# EAGLE design Reference_Design (EAGLE 9.5.1)
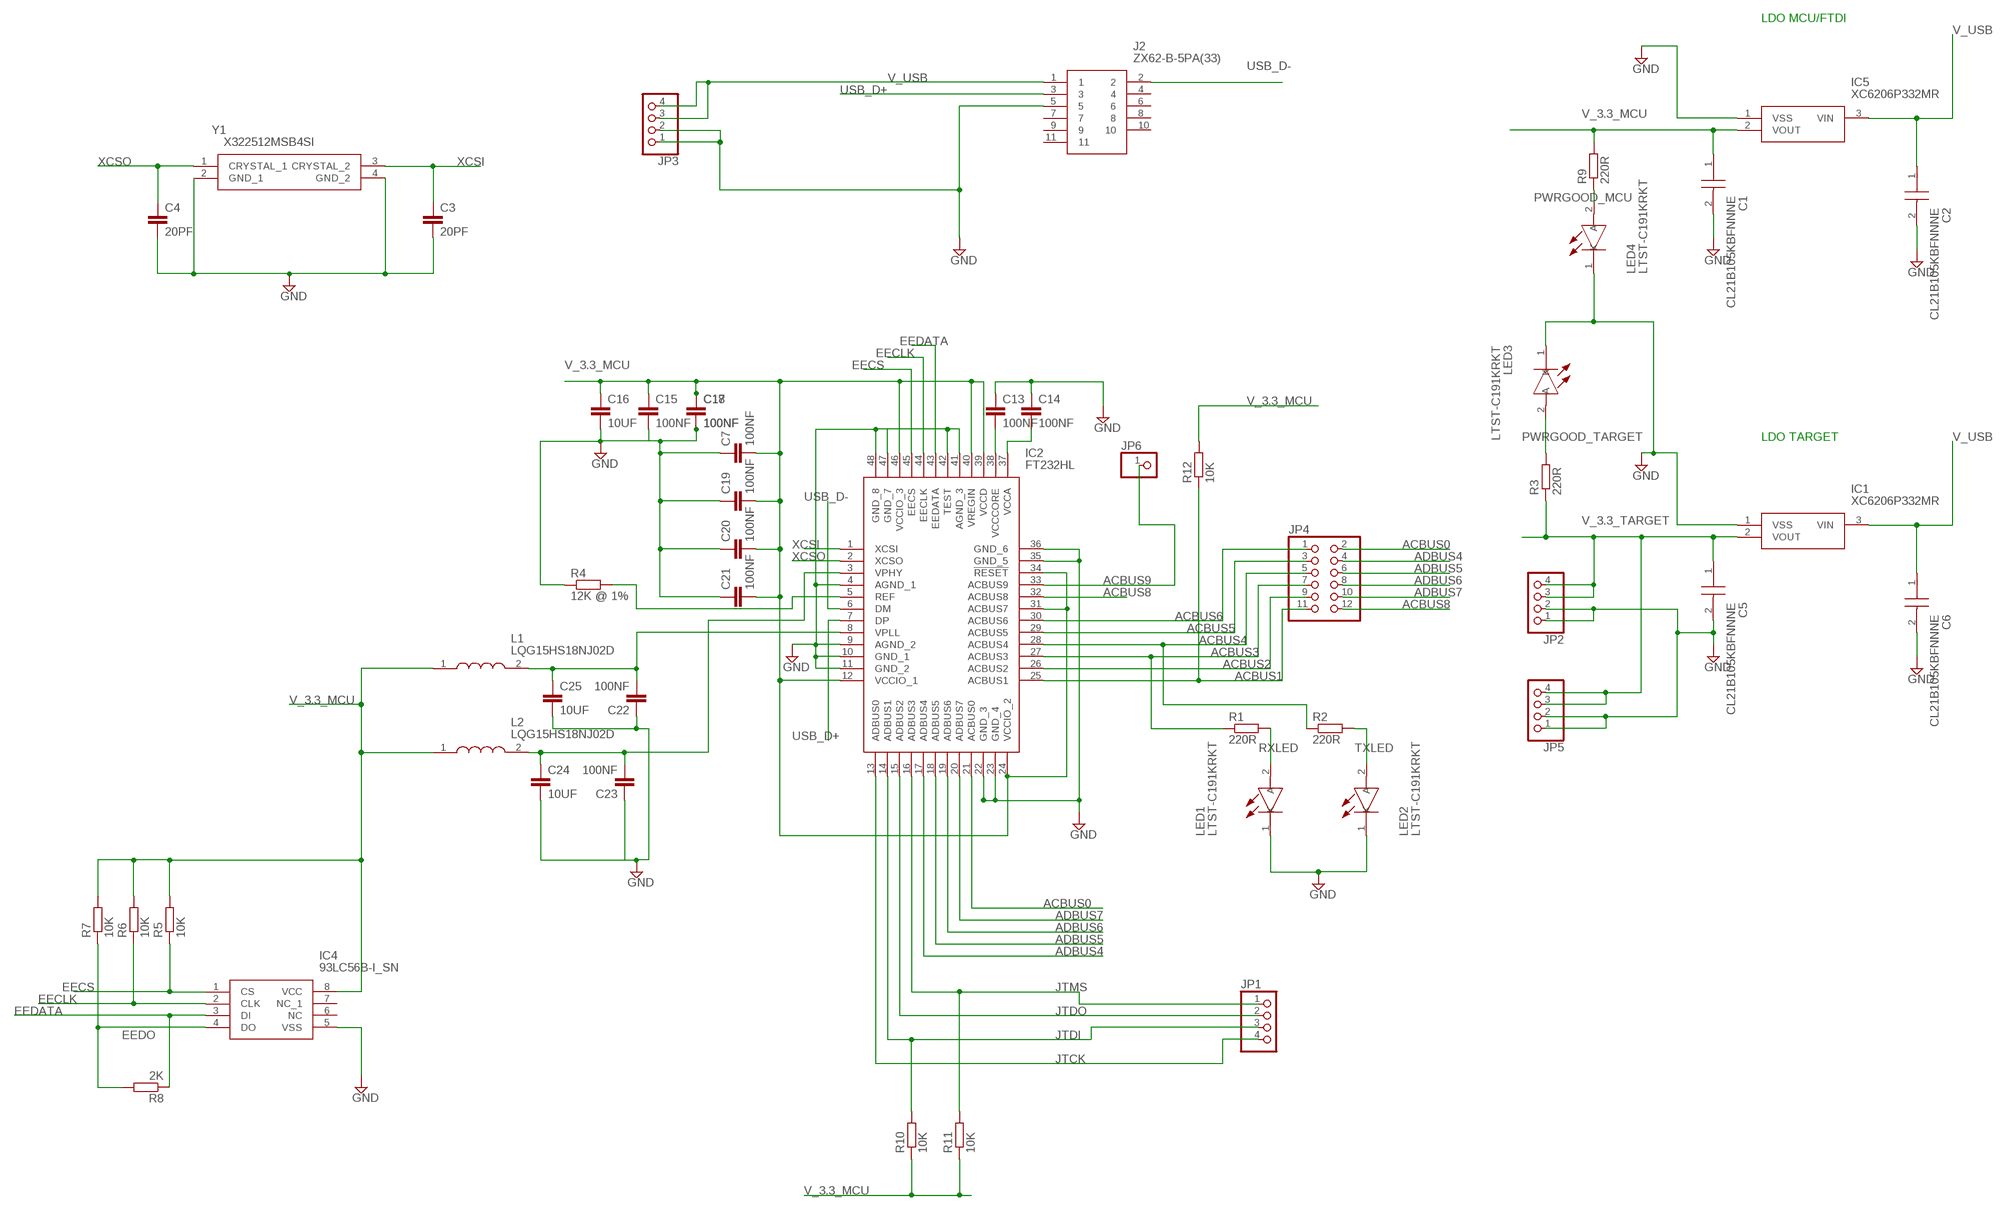
[diagram p0: schematic, sheet 1]

## Parts
C1  CL21B105KBFNNNE  [CAPC2012X135N]
C2  CL21B105KBFNNNE  [CAPC2012X135N]
C3  20PF  C-EUC0603  [C0603]
C4  20PF  C-EUC0603  [C0603]
C5  CL21B105KBFNNNE  [CAPC2012X135N]
C6  CL21B105KBFNNNE  [CAPC2012X135N]
C7  100NF  C-EUC0603  [C0603]
C13  100NF  C-EUC0603  [C0603]
C14  100NF  C-EUC0603  [C0603]
C15  100NF  C-EUC0603  [C0603]
C16  10UF  C-EUC1206  [C1206]
C17  100NF  C-EUC0603  [C0603]
C18  100NF  C-EUC0603  [C0603]
C19  100NF  C-EUC0603  [C0603]
C20  100NF  C-EUC0603  [C0603]
C21  100NF  C-EUC0603  [C0603]
C22  100NF  C-EUC0603  [C0603]
C23  100NF  C-EUC0603  [C0603]
C24  10UF  C-EUC1206  [C1206]
C25  10UF  C-EUC1206  [C1206]
IC1  XC6206P332MR  [SOT95P280X130-3N]
IC2  FT232HL  FT232HL-REEL  [QFP50P900X900X160-48N]
IC4  93LC56B-I_SN  [SOIC127P600X175-8N]
IC5  XC6206P332MR  [SOT95P280X130-3N]
J2  ZX62-B-5PA(33)  [ZX62B5PA33]
JP1  PINHD-1X4  [1X04]
JP2  PINHD-1X4  [1X04]
JP3  PINHD-1X4  [1X04]
JP4  PINHD-2X6  [2X06]
JP5  PINHD-1X4  [1X04]
JP6  PINHD-1X1  [1X01]
L1  LQG15HS18NJ02D  [INDC1005X55N]
L2  LQG15HS18NJ02D  [INDC1005X55N]
LED1  LTST-C191KRKT  [LEDC1608X55N]
LED2  LTST-C191KRKT  [LEDC1608X55N]
LED3  LTST-C191KRKT  [LEDC1608X55N]
LED4  LTST-C191KRKT  [LEDC1608X55N]
R1  220R  R-EU_R0603  [R0603]
R2  220R  R-EU_R0603  [R0603]
R3  220R  R-EU_R0603  [R0603]
R4  12K @ 1%  R-EU_R0603  [R0603]
R5  10K  R-EU_R1206  [R1206]
R6  10K  R-EU_R1206  [R1206]
R7  10K  R-EU_R1206  [R1206]
R8  2K  R-EU_R1206  [R1206]
R9  220R  R-EU_R0603  [R0603]
R10  10K  R-EU_R1206  [R1206]
R11  10K  R-EU_R1206  [R1206]
R12  10K  R-EU_R1206  [R1206]
Y1  X322512MSB4SI  [X322512MSB4SI]

## Nets
ACBUS0: IC2.21(ACBUS0) JP4.2
ACBUS1: IC2.25(ACBUS1) JP4.11 R12.1
ACBUS2: IC2.26(ACBUS2) JP4.9
ACBUS3: IC2.27(ACBUS3) JP4.7 R1.1
ACBUS4: IC2.28(ACBUS4) JP4.5 R2.1
ACBUS5: IC2.29(ACBUS5) JP4.3
ACBUS6: IC2.30(ACBUS6) JP4.1
ACBUS8: IC2.32(ACBUS8) JP4.12
ACBUS9: IC2.33(ACBUS9) JP6.1
ADBUS4: IC2.17(ADBUS4) JP4.4
ADBUS5: IC2.18(ADBUS5) JP4.6
ADBUS6: IC2.19(ADBUS6) JP4.8
ADBUS7: IC2.20(ADBUS7) JP4.10
EECLK: IC2.44(EECLK) IC4.2(CLK) R6.1
EECS: IC2.45(EECS) IC4.1(CS) R5.1
EEDATA: IC2.43(EEDATA) IC4.3(DI) R8.1
EEDO: IC4.4(DO) R7.1 R8.2
GND: C1.2 C2.2 C3.2 C4.2 C5.2 C6.2 C7.1 C13.1 C14.1 C15.2 C16.2 C17.2 C18.2 C19.1 C20.1 C21.1 C22.1 C23.1 C24.2 C25.2 IC1.1(VSS) IC2.4(AGND_1) IC2.9(AGND_2) IC2.10(GND_1) IC2.11(GND_2) IC2.22(GND_3) IC2.23(GND_4) IC2.35(GND_5) IC2.36(GND_6) IC2.41(AGND_3) IC2.42(TEST) IC2.47(GND_7) IC2.48(GND_8) IC4.5(VSS) IC5.1(VSS) J2.5 JP2.1 JP2.2 JP3.1 JP3.2 JP5.1 JP5.2 LED1.1(K) LED2.1(K) LED3.1(K) LED4.1(K) R4.1 Y1.2(GND_1) Y1.4(GND_2)
JTCK: IC2.13(ADBUS0) JP1.4
JTDI: IC2.14(ADBUS1) JP1.3 R10.2
JTDO: IC2.15(ADBUS2) JP1.2
JTMS: IC2.16(ADBUS3) JP1.1 R11.2
PWRGOOD_MCU: LED4.2(A) R9.1
PWRGOOD_TARGET: LED3.2(A) R3.2
REF: IC2.5(REF) R4.2
RXLED: LED1.2(A) R1.2
TXLED: LED2.2(A) R2.2
USB_D+: IC2.7(DP) J2.3
USB_D-: IC2.6(DM) J2.2
V_3.3_MCU: C1.1 C7.2 C15.1 C16.1 C17.1 C18.1 C19.2 C20.2 C21.2 IC2.12(VCCIO_1) IC2.24(VCCIO_2) IC2.31(ACBUS7) IC2.34(!RESET) IC2.39(VCCD) IC2.40(VREGIN) IC2.46(VCCIO_3) IC4.8(VCC) IC5.2(VOUT) L1.1 L2.1 R5.2 R6.2 R7.2 R9.2 R10.1 R11.1 R12.2
V_3.3_TARGET: C5.1 IC1.2(VOUT) JP2.3 JP2.4 JP5.3 JP5.4 R3.1
V_USB: C2.1 C6.1 IC1.3(VIN) IC5.3(VIN) J2.1 JP3.3 JP3.4
VCCA: C14.2 IC2.37(VCCA)
VCCCORE: C13.2 IC2.38(VCCCORE)
VPHY: C23.2 C24.1 IC2.3(VPHY) L2.2
VPLL: C22.2 C25.1 IC2.8(VPLL) L1.2
XCSI: C3.1 IC2.1(XCSI) Y1.3(CRYSTAL_2)
XCSO: C4.1 IC2.2(XCSO) Y1.1(CRYSTAL_1)
Unconnected: IC4.6(NC) IC4.7(NC_1) J2.4 J2.6 J2.7 J2.8 J2.9 J2.10 J2.11

## Notes on the sheet
- LDO MCU/FTDI
- LDO TARGET

## Library data of the parts
C1 C2 C5 C6 = SamacSys:CL21B105KBFNNNE: SAMSUNG ELECTRO-MECHANICS - CL21B105KBFNNNE - CERAMIC MULTILAYER MLCC CAPACITORS- SMD Source: Datasheet <https://componentsearchengine.com/Datasheets/2/CL21B105KBFNNNE.pdf>; DESCRIPTION: SAMSUNG ELECTRO-MECHANICS - CL21B105KBFNNNE - CERAMIC MULTILAYER MLCC CAPACITORS- SMD; HEIGHT: 1.35mm; MANUFACTURER_NAME: Samsung Electro-Mechanics; MANUFACTURER_PART_NUMBER: CL21B105KBFNNNE; MOUSER_PART_NUMBER: N/A; MOUSER_PRICE-STOCK: https://www.mouser.com/Search/Refine.aspx?Keyword=N%2FA
C3 C4 C7 C13-C25 = rcl:C-EU: CAPACITOR, European symbol; SPICEPREFIX: C
IC1 IC5 = SamacSys:XC6206P332MR: Low ESR Cap.Compatible Postive Voltage Regulators Source: Datasheet <http://www.torexsemi.com/products/voltage_regulators/data/XC6206.pdf>; DESCRIPTION: Low ESR Cap.Compatible Postive Voltage Regulators; HEIGHT: 1.3mm; MANUFACTURER_NAME: Torex; MANUFACTURER_PART_NUMBER: XC6206P332MR
IC2 = SamacSys:FT232HL-REEL: USB 2.0 to UART/FIFO Interface, LQFP48 FTDI Chip FT232HL-REEL Universal Asynchronous Receiver & Transmitter RS232, RS422, RS485 UART 12Mbit/s, 1.8 V, 3.3 V Source: Datasheet <http://www.ftdichip.com/Support/Documents/DataSheets/ICs/DS_FT232H.pdf>; ALLIED_NUMBER: 70069390; ALLIED_PRICE-STOCK: http://www.alliedelec.com/ftdi-ft232hl-reel/70069390/; DESCRIPTION: USB 2.0 to UART/FIFO Interface, LQFP48 FTDI Chip FT232HL-REEL Universal Asynchronous Receiver & Transmitter RS232, RS422, RS485 UART 12Mbit/s, 1.8 V, 3.3 V; HEIGHT: 1.6mm; MANUFACTURER_NAME: FTDI Chip; MANUFACTURER_PART_NUMBER: FT232HL-REEL; MOUSER_PART_NUMBER: 895-FT232HL-REEL; MOUSER_PRICE-STOCK: https://www.mouser.com/Search/Refine.aspx?Keyword=895-FT232HL-REEL; RS_PART_NUMBER: 7377843P; RS_PRICE-STOCK: http://uk.rs-online.com/web/p/products/7377843P
IC4 = SamacSys:93LC56B-I_SN: 2K,128 X 16,Serial EE,SOIC-8 Source: Datasheet <http://ww1.microchip.com/downloads/en/DeviceDoc/21794G.pdf>; ALLIED_NUMBER: 70045309; ALLIED_PRICE-STOCK: http://www.alliedelec.com/microchip-technology-inc-93lc56b-i-sn/70045309/; DESCRIPTION: 2K,128 X 16,Serial EE,SOIC-8; HEIGHT: 1.75mm; MANUFACTURER_NAME: Microchip; MANUFACTURER_PART_NUMBER: 93LC56B-I/SN; MOUSER_PART_NUMBER: 579-93LC56BISN; MOUSER_PRICE-STOCK: https://www.mouser.com/Search/Refine.aspx?Keyword=579-93LC56BISN; RS_PART_NUMBER: 0454347P; RS_PRICE-STOCK: http://uk.rs-online.com/web/p/products/0454347P
J2 = SamacSys:ZX62-B-5PA(33): USB Connectors MICRO B RECEPT RA SMT BTTM MNT Source: Datasheet <http://www.mouser.com/ds/2/185/ZX_catalog-939768.pdf>; DESCRIPTION: USB Connectors MICRO B RECEPT RA SMT BTTM MNT; HEIGHT: 2.8mm; MANUFACTURER_NAME: Hirose; MANUFACTURER_PART_NUMBER: ZX62-B-5PA(33); MOUSER_PART_NUMBER: 798-ZX62-B-5PA33; MOUSER_PRICE-STOCK: https://www.mouser.com/Search/Refine.aspx?Keyword=798-ZX62-B-5PA33; RS_PART_NUMBER: 1362267; RS_PRICE-STOCK: http://uk.rs-online.com/web/p/products/1362267
JP1-JP3 JP5 = pinhead:PINHD-1X4: PIN HEADER
JP4 = pinhead:PINHD-2X6: PIN HEADER
JP6 = pinhead:PINHD-1X1: PIN HEADER
L1 L2 = SamacSys:LQG15HS18NJ02D: Murata LQQ15HN Series Wire-wound SMD Inductor 0.018 uH +/-5% 300mA Idc Q:8 Source: Datasheet <https://psearch.en.murata.com/inductor/product/LQG15HS18NJ02#.html>; DESCRIPTION: Murata LQQ15HN Series Wire-wound SMD Inductor 0.018 uH +/-5% 300mA Idc Q:8; HEIGHT: 0.55mm; MANUFACTURER_NAME: Murata Electronics; MANUFACTURER_PART_NUMBER: LQG15HS18NJ02D; MOUSER_PART_NUMBER: 81-LQG15HS18NJ02D; MOUSER_PRICE-STOCK: https://www.mouser.com/Search/Refine.aspx?Keyword=81-LQG15HS18NJ02D; RS_PART_NUMBER: 7254910; RS_PRICE-STOCK: https://uk.rs-online.com/web/p/products/7254910
LED1-LED4 = SamacSys:LTST-C191KRKT: Standard LEDs - SMD Red Clear 631nm Source: Datasheet <http://www.mouser.com/ds/2/239/S_110_LTST-C191KRKT-539838.pdf>; DESCRIPTION: Standard LEDs - SMD Red Clear 631nm; HEIGHT: 0.55mm; MANUFACTURER_NAME: Lite-On; MANUFACTURER_PART_NUMBER: LTST-C191KRKT; MOUSER_PART_NUMBER: 859-LTST-C191KRKT; MOUSER_PRICE-STOCK: https://www.mouser.com/Search/Refine.aspx?Keyword=859-LTST-C191KRKT; RS_PART_NUMBER: 1278415P; RS_PRICE-STOCK: http://uk.rs-online.com/web/p/products/1278415P
R1-R12 = rcl:R-EU_: RESISTOR, European symbol; SPICEPREFIX: R
Y1 = SamacSys:X322512MSB4SI: SMD Crystal Resonators 12MHz +/-10ppm SMD-3225_4P RoHS Source: Datasheet <https://datasheet.lcsc.com/szlcsc/Yangxing-Tech-X322512MSB4SI_C9002.pdf>; DESCRIPTION: SMD Crystal Resonators 12MHz +/-10ppm SMD-3225_4P RoHS; HEIGHT: 0.8mm; MANUFACTURER_NAME: Yangxing Tech; MANUFACTURER_PART_NUMBER: X322512MSB4SI

## Board
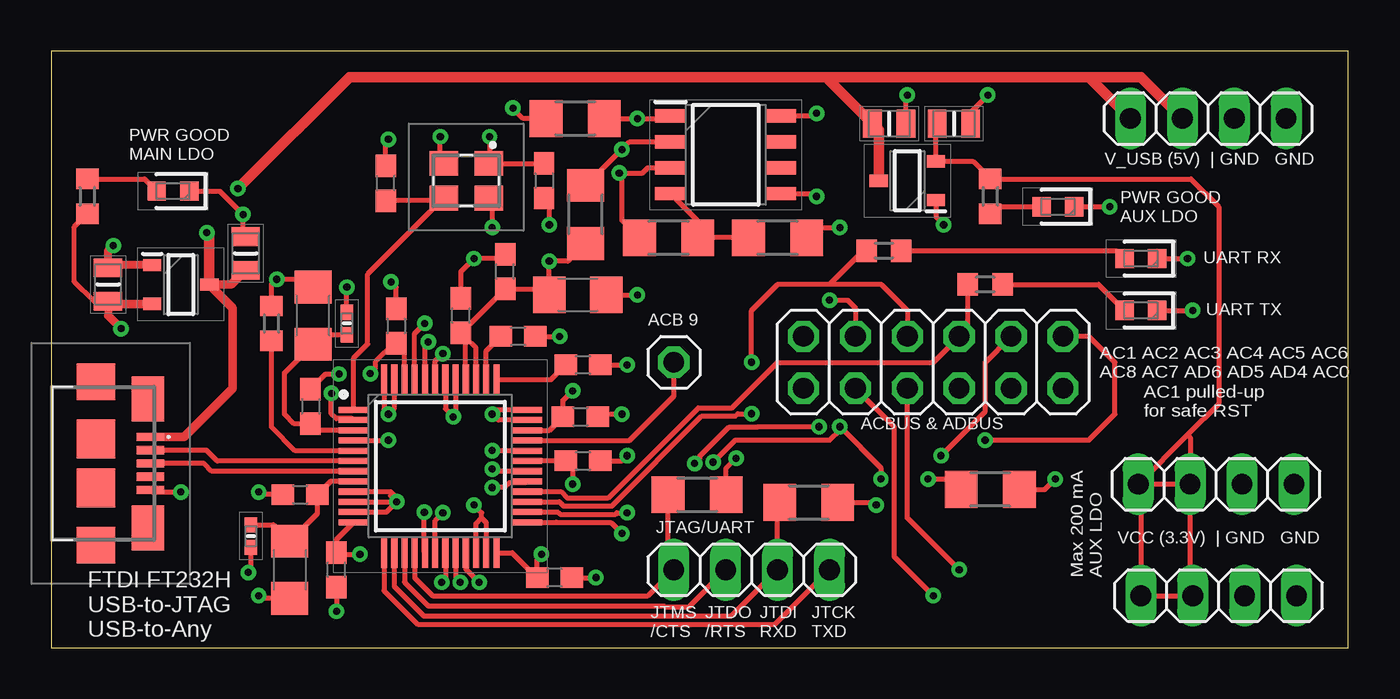
[diagram p1: board, top side]
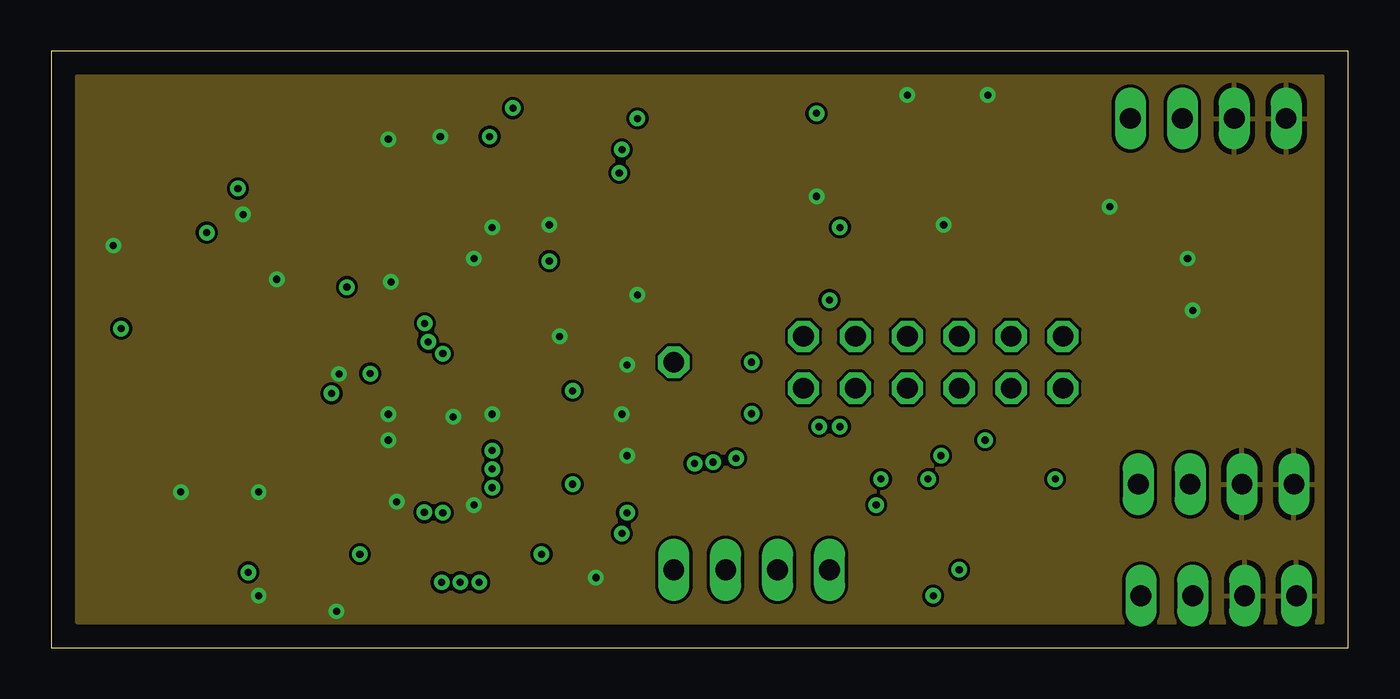
[diagram p2: board, inner layer Route2]
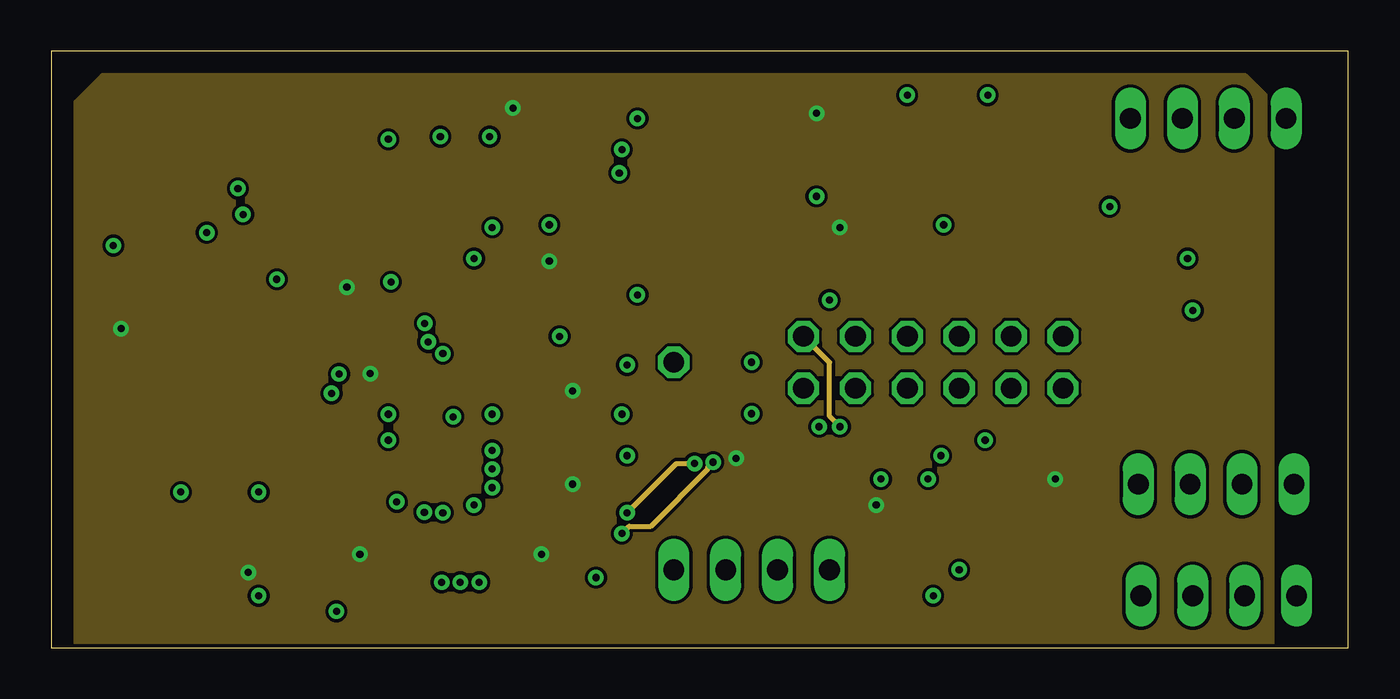
[diagram p3: board, inner layer Route15]
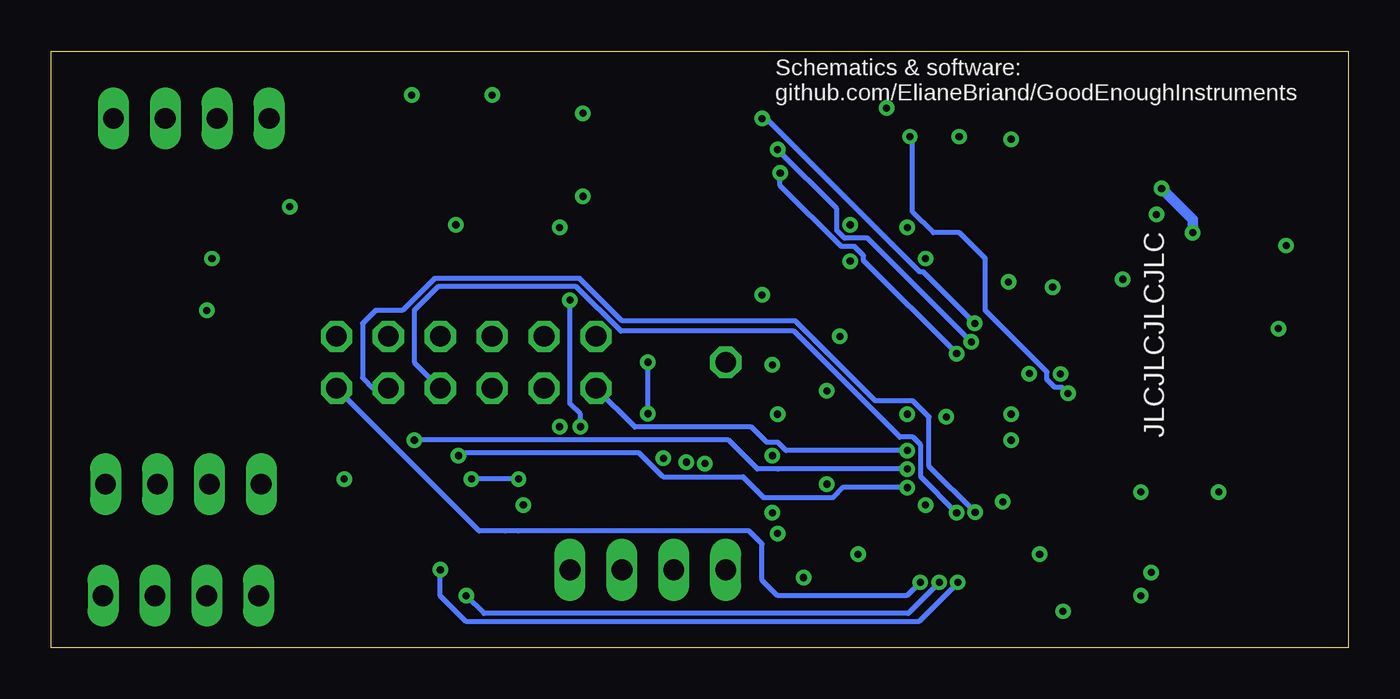
[diagram p4: board, bottom side, seen from below]

Size 63.5 x 29.21 mm. Coordinates in mm from the lower left corner, seen from the top.
Outline: 0,0 63.5,0 63.5,29.21 0,29.21 0,0
Copper layers (1+2*15+16): Top 0.035mm / dielectric 1.5mm / Route2 0.035mm / dielectric 0.15mm / Route15 0.035mm / dielectric 0.2mm / Bottom 0.035mm
Design rules "JLCPCB_MoreThanMinimum": minimum track width 6mil, minimum drill 0.35mm, track to track 6mil, track to pad 6mil, pad to pad 6mil, via to via 6mil, smd to smd 6mil, copper to edge 0.2mm, drill to drill 6mil, minimum pad ring 10mil, minimum via ring 8mil, stop-mask expansion 4mil, vias tented up to drill 0mil, thermal gap 10mil

### Footprints (pad centres in the part's own frame; a part is rotated, then mirrored left to right if it is on the bottom)
CAPC2012X135N = smd 0.91 x 1.39: 1 -0.82,0; 2 0.82,0
C0603 = smd 1.1 x 1: 1 -0.85,0; 2 0.85,0
C1206 = smd 1.6 x 1.8: 1 -1.4,0; 2 1.4,0
SOT95P280X130-3N = smd 0.9 x 0.6: 1 -1.4,0.95; 2 -1.4,-0.95; 3 1.4,0
QFP50P900X900X160-48N = smd 1.475 x 0.3: 1 -4.238,2.75; 2 -4.238,2.25; 3 -4.238,1.75; 4 -4.238,1.25; 5 -4.238,0.75; 6 -4.238,0.25; 7 -4.238,-0.25; 8 -4.238,-0.75; 9 -4.238,-1.25; 10 -4.238,-1.75; 11 -4.238,-2.25; 12 -4.238,-2.75; 25 4.238,-2.75; 26 4.238,-2.25; 27 4.238,-1.75; 28 4.238,-1.25; 29 4.238,-0.75; 30 4.238,-0.25; 31 4.238,0.25; 32 4.238,0.75; 33 4.238,1.25; 34 4.238,1.75; 35 4.238,2.25; 36 4.238,2.75 | smd 0.3 x 1.475: 13 -2.75,-4.238; 14 -2.25,-4.238; 15 -1.75,-4.238; 16 -1.25,-4.238; 17 -0.75,-4.238; 18 -0.25,-4.238; 19 0.25,-4.238; 20 0.75,-4.238; 21 1.25,-4.238; 22 1.75,-4.238; 23 2.25,-4.238; 24 2.75,-4.238; 37 2.75,4.238; 38 2.25,4.238; 39 1.75,4.238; 40 1.25,4.238; 41 0.75,4.238; 42 0.25,4.238; 43 -0.25,4.238; 44 -0.75,4.238; 45 -1.25,4.238; 46 -1.75,4.238; 47 -2.25,4.238; 48 -2.75,4.238
SOIC127P600X175-8N = smd 1.5 x 0.65: 1 -2.7,1.905; 2 -2.7,0.635; 3 -2.7,-0.635; 4 -2.7,-1.905; 5 2.7,-1.905; 6 2.7,-0.635; 7 2.7,0.635; 8 2.7,1.905
ZX62B5PA33 = smd 0.4 x 1.35: 1 -1.3,1.95; 2 -0.65,1.95; 3 0,1.95; 4 0.65,1.95; 5 1.3,1.95 | smd 2.2 x 1.6: 6 -3.15,1.825; 7 3.15,1.825 | smd 1.8 x 1.9: 8 -4,-0.725; 11 4,-0.725 | smd 1.9 x 1.9: 9 -1.2,-0.725; 10 1.2,-0.725
1X04 = drill 1.016 long: 1 -3.81,0; 2 -1.27,0; 3 1.27,0; 4 3.81,0
2X06 = drill 1.016 octagon: 1 -6.35,-1.27; 2 -6.35,1.27; 3 -3.81,-1.27; 4 -3.81,1.27; 5 -1.27,-1.27; 6 -1.27,1.27; 7 1.27,-1.27; 8 1.27,1.27; 9 3.81,-1.27; 10 3.81,1.27; 11 6.35,-1.27; 12 6.35,1.27
1X01 = drill 1.016 octagon: 1 0,0
INDC1005X55N = smd 0.75 x 0.6: 1 -0.55,0; 2 0.55,0
LEDC1608X55N = smd 0.9 x 0.95: 1 -0.8,0; 2 0.8,0
R0603 = smd 1 x 1.1: 1 -0.85,0; 2 0.85,0
R1206 = smd 1.6 x 1.803: 1 -1.422,0; 2 1.422,0
X322512MSB4SI = smd 1.4 x 1.2: 1 -1.1,-0.85; 2 1.1,-0.85; 3 1.1,0.85; 4 -1.1,0.85

### Placement (x,y rotation side)
C1  2.79,17.78 90 top
C2  9.53,19.3 90 top
C3  16.38,22.73 90 top
C4  24.13,22.86 270 top
C5  44.2,25.65 0 top
C6  41.02,25.65 0 top
C7  24.64,3.43 180 top
C13  22.86,15.24 180 top
C14  26.04,13.84 180 top
C15  25.91,11.3 0 top
C16  25.78,17.27 0 top
C17  22.23,18.41 90 top
C18  20.07,16.26 90 top
C19  16.89,15.75 270 top
C20  26.04,9.14 180 top
C21  13.97,3.81 90 top
C22  12.19,7.49 0 top
C23  12.7,11.81 270 top
C24  12.83,16.26 90 top
C25  11.68,3.81 270 top
IC1  41.91,22.86 180 top
IC2  19.05,8.89 0 top
IC4  33.02,24.13 0 top
IC5  6.35,17.78 0 top
J2  2.92,9.02 270 top
JP1  34.29,3.81 0 top
JP2  57.15,2.54 180 top
JP3  56.64,25.91 180 top
JP4  43.18,13.97 180 top
JP5  57.02,8 180 top
JP6  30.48,13.97 0 top
L1  9.78,5.46 90 top
L2  14.48,15.88 270 top
LED1  53.34,19.05 180 top
LED2  53.34,16.51 180 top
LED3  49.28,21.59 180 top
LED4  5.97,22.35 180 top
R1  40.77,19.43 0 top
R2  45.72,17.78 0 top
R3  45.97,22.1 270 top
R4  10.79,15.88 270 top
R5  25.65,25.91 180 top
R6  26.16,21.21 270 top
R7  35.56,20.07 0 top
R8  30.23,20.07 0 top
R9  1.78,22.1 270 top
R10  37.08,7.11 180 top
R11  31.62,7.49 180 top
R12  45.97,7.75 0 top
Y1  20.32,22.86 180 top

### Tracks (layer width: path | path; a pad name or v marks a point on that pad's centre or on a via)
ACBUS0  (via drill 0.35)
  Top 0.254: IC2.21 20.3,3.85 v20.95,3.2
  Bottom 0.254: v20.95,3.2 21.61,2.54 27.94,2.54 28.7,3.3 28.7,5.08 29.34,5.71 40.64,5.71 41.27,5.71 42.55,5.71 JP4.2
ACBUS1  (via drill 0.35)
  Top 0.254: IC2.25 24.73,6.14 24.75,6.12 27.4,6.12 v27.94,5.59 | v32.41,9.08 33.49,10.16 38.1,10.16 38.61,10.67 v38.61,10.82 40.62,8.81 v40.62,8.26 | v42.93,8.26 44.04,8.26 R12.1
  Route15 0.254: v27.94,5.59 28.3,5.95 29.36,5.95 32.15,8.74 32.15,8.83 v32.41,9.08 | v38.61,10.82 38.1,11.33 38.1,13.97 JP4.11
  Bottom 0.254: v40.62,8.26 v42.93,8.26
ACBUS2  (via drill 0.35)
  Top 0.254: IC2.26 24.81,6.64 24.92,6.53 27.62,6.53 27.69,6.6 v28.19,6.6 | v31.5,9.02 31.75,9.27 31.75,9.35 33.19,10.79 34.56,10.79 34.59,10.82 v37.59,10.82 | v38.1,17.02 38.99,17.02 39.37,16.64 JP4.9
  Route15 0.254: v28.19,6.6 30.61,9.02 v31.5,9.02
  Bottom 0.254: v37.59,10.82 37.59,11.43 38.1,11.94 v38.1,17.02
ACBUS3  (via drill 0.35)
  Top 0.254: IC2.27 24.88,7.14 25.09,6.94 27.45,6.94 31.85,11.33 33.5,11.33 33.62,11.45 v34.29,11.45 | v34.29,13.97 34.29,16.51 35.56,17.78 38.1,17.78 | 38.1,17.78 40.64,17.78 41.91,16.51 JP4.7 | 38.1,17.78 39.75,19.43 R1.1
  Bottom 0.254: v34.29,11.45 v34.29,13.97
ACBUS4
  Top 0.254: IC2.28 24.96,7.64 25.25,7.34 27.28,7.34 31.68,11.74 33.33,11.74 35.56,13.97 43.18,13.97 JP4.5 44.87,15.66 R2.1
ACBUS5  (via drill 0.35)
  Top 0.254: IC2.29 23.22,8.07 22.43,8.07 22.2,7.83 v21.59,7.83 | v43.56,9.4 45.72,11.56 45.72,13.97 JP4.3
  Bottom 0.254: v21.59,7.83 24.76,7.83 25.25,7.34 28.61,7.34 29.62,8.36 33.55,8.36 34.71,9.53 43.43,9.53 v43.56,9.4
ACBUS6  (via drill 0.35)
  Top 0.254: IC2.30 21.69,8.64 v21.59,8.74 | v45.72,10.16 50.8,10.16 52.07,11.43 52.07,13.97 50.8,15.24 JP4.1
  Bottom 0.254: v21.59,8.74 27.92,8.74 28.93,8.74 30.35,10.16 v45.72,10.16
ACBUS8  (via drill 0.35)
  Top 0.254: IC2.32 21.6,9.64 v21.59,9.65
  Bottom 0.254: v21.59,9.65 27.52,9.65 27.92,10.06 28.47,10.06 29.21,10.79 34.92,10.79 JP4.12
ACBUS9
  Top 0.254: IC2.33 28.3,10.14 30.48,12.32 JP6.1
ADBUS4  (via drill 0.35)
  Top 0.254: IC2.17 18.27,4.68 v18.27,6.62
  Bottom 0.254: v18.27,6.62 20.53,8.88 20.53,11.3 21.32,12.09 23.16,12.09 27.07,16 35.54,16 37.62,18.08 44.72,18.08 46.3,16.51 47.62,16.51 48.26,15.88 48.26,13.21 47.75,12.7 JP4.4
ADBUS5  (via drill 0.35)
  Top 0.254: IC2.18 18.8,6.23 v19.18,6.6
  Bottom 0.254: v19.18,6.6 20.93,8.36 20.93,9.92 21.32,10.31 21.95,10.31 27.14,15.49 35.61,15.49 37.79,17.68 44.55,17.68 45.72,16.51 45.72,13.97 JP4.6
ADBUS6  (via drill 0.35)
  Top 0.254: IC2.19 19.3,3.38 v19.12,3.2 | v44.45,3.81 41.91,6.35 JP4.8
  Bottom 0.254: v19.12,3.2 19.37,2.95 19.37,2.92 21.02,1.27 43.18,1.27 44.45,2.54 v44.45,3.81
ADBUS7  (via drill 0.35)
  Top 0.254: IC2.20 19.8,3.42 v20.02,3.2 | v43.18,2.54 41.27,4.45 41.27,10.79 JP4.10
  Bottom 0.254: v20.02,3.2 21.55,1.68 42.32,1.68 v43.18,2.54
EECLK  (via drill 0.35)
  Top 0.254: IC2.44 18.3,14.81 v18.46,14.97 | IC4.2 28.32,24.77 v27.94,24.38 27.91,24.38 R6.1
  Bottom 0.254: v18.46,14.97 23.54,20.04 24.66,20.04 25.04,20.43 25.04,21.49 v27.94,24.38
EECS  (via drill 0.35)
  Top 0.254: IC2.45 17.8,15.39 v18.29,15.88 | IC4.1 30.19,25.91 v28.7,25.91 R5.1
  Bottom 0.254: v18.29,15.88 20.8,18.39 20.97,18.39 28.49,25.91 v28.7,25.91
EEDATA  (via drill 0.35)
  Top 0.254: IC2.43 18.8,14.02 v19.17,14.4 | v27.81,23.24 27.94,23.24 | 27.94,23.24 28.96,23.24 29.21,23.5 IC4.3 | R8.1 27.94,20.93 27.94,23.24
  Bottom 0.254: v19.17,14.4 23.73,18.95 23.73,19.2 24.17,19.64 24.82,19.64 27.81,22.62 v27.81,23.24
EEDO
  Top 0.254: IC4.4 31.65,20.9 R8.2 R7.1
GND  (via drill 0.35)
  Top 0.254: IC2.11 16.42,6.64 v16.92,7.14 | IC2.9 16.62,7.64 | IC2.10 v16.92,7.14 | v16.92,7.14 17.02,7.24 16.62,7.64 | IC2.4 16.49,10.14 v16.51,10.16 | IC2.48 16.3,11.64 v16.51,11.43 16.8,11.72 IC2.47 | J2.5 4.97,7.62 v6.35,7.62 | C25.2 10.29,2.41 v10.16,2.54 | C21.1 v13.97,1.78 | C22.1 10.29,7.49 v10.16,7.62 | 16.62,7.64 16.62,7.44 v16.92,7.14 | C23.1 13.44,13.4 v14.1,13.4 | C24.2 12.45,18.03 v11.05,18.03 10.79,17.78 R4.1 | C2.2 9.4,20.25 v9.4,21.21 8.26,22.35 LED4.1 | C3.2 16.38,24.77 v16.51,24.89 | C4.2 24.38,21.76 v24.38,20.7 | Y1.2 19.05,23.88 v19.05,25.02 | Y1.4 21.59,21.84 v21.59,20.57 | IC2.22 20.8,6.07 21.08,6.35 | 21.08,6.35 21.3,6.13 IC2.23 | 21.08,6.35 21.08,6.6 v20.7,6.99 | IC2.36 21.67,11.64 21.59,11.56 v21.59,11.43 21.88,11.14 IC2.35 | IC2.42 19.3,11.69 v19.68,11.3 19.8,11.42 IC2.41 | C16.2 v28.7,17.27 | C17.2 22.01,19.05 v20.7,19.05 20.07,18.41 C18.2 | C19.1 16.89,17.65 v16.64,17.91 | C13.1 v24.89,15.24 | C14.1 v28.19,13.84 | C15.2 26.89,11.43 v27.94,11.43 | C20.1 27.94,9.14 v28.19,9.4 | C7.1 v26.67,3.43 | IC4.5 37.34,22.23 v37.47,22.1 | IC1.1 43.31,21.08 v43.69,20.7 | C6.2 41.84,26.98 v41.91,27.05 | C5.2 45.02,26.22 v45.85,27.05 | LED3.1 v51.82,21.59 | LED1.1 v55.63,19.05 | LED2.1 v55.88,16.51
  Top 0.381: IC5.1 2.92,18.73 C1.2 2.79,19.43 v3.05,19.68
  pour Route2: 1.27,1.27 62.23,1.27 62.23,27.94 1.27,27.94
JTCK
  Top 0.254: IC2.13 16.3,2.79 17.94,1.14 35.43,1.14 JP1.4
JTDI
  Top 0.254: IC2.14 16.8,2.99 18.24,1.55 33.3,1.55 JP1.3 35.56,7.01 R10.2
JTDO
  Top 0.254: IC2.15 17.3,3.2 18.46,2.04 30.02,2.04 30.05,2.01 31.22,2.01 JP1.2
JTMS
  Top 0.254: IC2.16 17.8,3.41 18.67,2.54 29.21,2.54 JP1.1 30.2,4.09 R11.2
PWRGOOD_MCU
  Top 0.254: R9.1 4.57,22.95 LED4.2
PWRGOOD_TARGET
  Top 0.254: R3.2 46.32,21.59 LED3.2
REF
  Top 0.254: IC2.5 11.95,9.64 10.79,10.79 R4.2
RXLED
  Top 0.254: R1.2 52.16,19.43 LED1.2
TXLED
  Top 0.254: R2.2 51.27,17.78 LED2.2
USB_D+
  Top 0.254: IC2.7 7.87,8.64 7.49,9.02 J2.3
USB_D-
  Top 0.254: IC2.6 8.13,9.14 7.61,9.67 J2.2
V_3.3_MCU  (via drill 0.35)
  Top 0.254: IC2.12 13.97,5.3 C21.2 14.06,4.57 v15.11,4.57 | L1.1 9.78,3.81 v9.65,3.68 | L2.1 v14.48,17.65 | IC2.46 17.3,14.49 C19.2 16.84,14.95 15.87,13.98 15.87,13.67 v15.62,13.42 | IC2.40 20.3,15.17 | IC2.39 20.8,14.67 20.3,15.17 | v24.38,18.92 C16.1 24.09,17.57 C17.1 C18.1 20.3,15.17 | v24.38,18.92 | IC2.34 24.39,10.64 C15.1 25.06,12.1 v25.53,12.57 | IC2.31 C20.2 25.53,8.8 v25.53,8 | IC2.24 22.57,4.65 C7.2 23.79,4.36 v24,4.57 | IC4.8 37.34,26.04 v37.47,26.16 | R5.2 23.11,25.91 v22.61,26.42 | R6.2 25.3,18.92 v24.38,18.92 | R7.2 37.49,20.57 v38.61,20.57 | C1.1 2.09,16.96 1.14,17.91 1.14,20.61 R9.2 | R10.1 40.26,7.11 v40.39,6.99 | R11.1 33.05,8.79 v33.53,9.27 | R12.2 48.64,7.75 v49.15,8.26
  Top 0.381: C1.1 2.79,16.26 v3.43,15.62
  Top 0.406: IC5.2 2.92,16.83 C1.1
  pour Route15: 1.27,0 59.69,0 59.69,26.67 58.42,27.94 2.54,27.94 1.27,26.67
V_3.3_TARGET
  Top 0.254: C5.1 43.31,25.59 IC1.2 45.11,23.81 R3.1 55.79,22.95 57.15,21.59 57.15,11.94 55.63,10.41 | 55.63,10.41 JP5.4 | 55.63,10.41 55.75,10.29 JP5.3 | JP5.4 53.34,7.87 JP2.4 JP2.3 55.75,2.67 JP5.3 | JP5.3 JP5.4
V_USB  (via drill 0.35)
  Top 0.406: J2.1 6.51,10.32 8.89,12.7 8.89,16.64 IC5.3 8.82,17.78 C2.1
  Top 0.508: IC5.3 7.75,20.19 v7.62,20.32 | v9.14,22.48 14.61,27.94 38.1,27.94 | JP3.4 50.8,27.94 | 38.1,27.94 50.8,27.94 | 50.8,27.94 53.34,27.94 JP3.3 | 38.1,27.94 38.1,27.75 C6.1 40.51,25.34 IC1.3
  Bottom 0.508: v7.62,20.32 7.62,20.95 v9.14,22.48
VCCA
  Top 0.254: IC2.37 24.47,13.13 C14.2
VCCCORE
  Top 0.254: IC2.38 21.3,14.53 C13.2
VPHY
  Top 0.254: IC2.3 13.02,10.64 C23.2 11.9,10.96 11.43,11.43 11.43,13.46 C24.1 13.3,15.32 L2.2
VPLL
  Top 0.254: IC2.8 13.69,8.14 C22.2 13.04,6.57 C25.1 10.88,6.01 L1.2
XCSI
  Top 0.254: IC2.1 14.81,14.18 15.49,14.86 15.49,18.28 Y1.3 19.09,21.88 C3.1
XCSO  (via drill 0.35)
  Top 0.254: IC2.2 14.74,11.21 13.96,11.21 13.72,11.45 13.72,12.45 v13.73,12.45 | v21.46,25.02 21.46,23.75 Y1.1 C4.1
  Bottom 0.254: v13.73,12.45 14.03,12.74 14.37,12.74 14.76,13.13 14.76,13.48 17.78,16.51 17.78,19.05 19.05,20.32 20.32,20.32 21.34,21.34 21.34,24.89 v21.46,25.02

### Text on the board
tNames: PWR GOOD / MAIN LDO | V_USB (5V) | GND GND | PWR GOOD / AUX LDO | UART RX | ACB 9 | UART TX | AC1 AC2 AC3 AC4 AC5 AC6 / AC8 AC7 AD6 AD5 AD4 AC0 | ACBUS & ADBUS | AC1 pulled-up / for safe RST | JTAG/UART | VCC (3.3V) | GND GND | Max 200 mA / AUX LDO | FTDI FT232H / USB-to-JTAG / USB-to-Any | JTMS / /CTS | JTDO / /RTS | JTDI / RXD | JTCK / TXD
bNames: Schematics & software: / github.com/ElianeBriand/GoodEnoughInstruments | JLCJLCJLCJLC